# Altium schematic sheet SCH_STM32_STEPMOTOR.SchDoc
size C
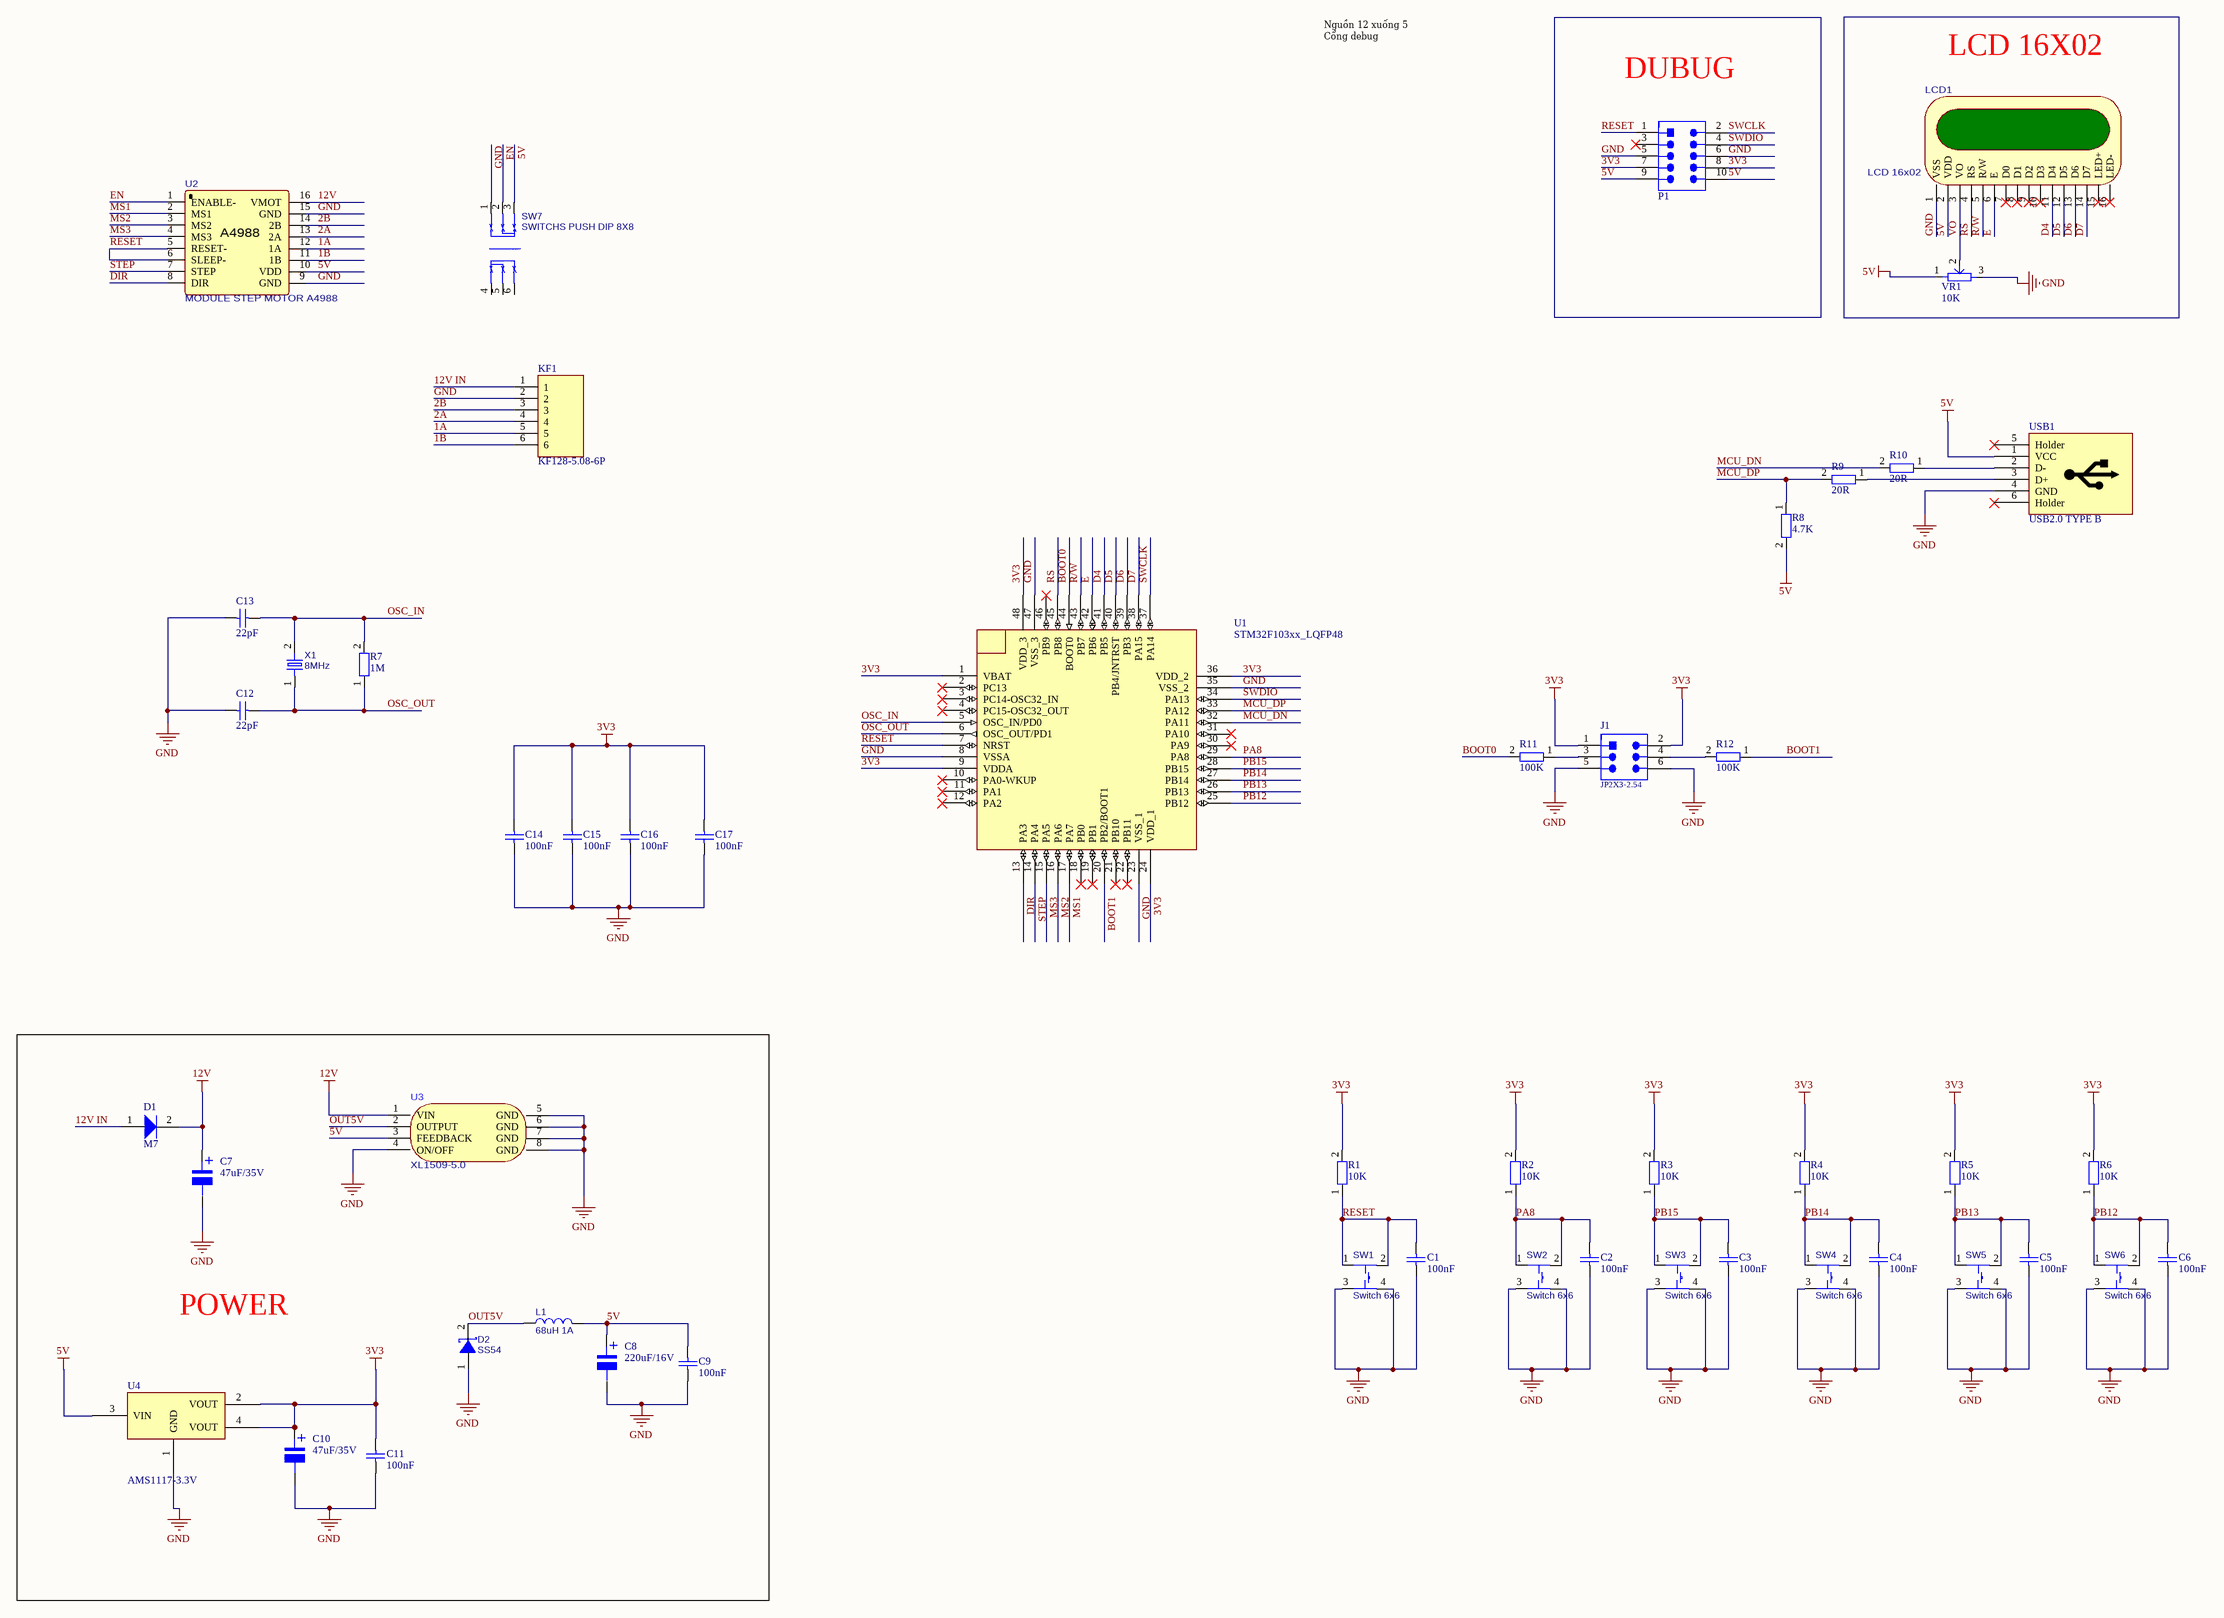
[diagram p0: SCH_STM32_STEPMOTOR.SchDoc]

## Parts
C1  100nF  [CAP CERAMIC SMD 0805 TyPE 2012]
C2  100nF  [CAP CERAMIC SMD 0805 TyPE 2012]
C3  100nF  [CAP CERAMIC SMD 0805 TyPE 2012]
C4  100nF  [CAP CERAMIC SMD 0805 TyPE 2012]
C5  100nF  [CAP CERAMIC SMD 0805 TyPE 2012]
C6  100nF  [CAP CERAMIC SMD 0805 TyPE 2012]
C7  47uF/35V  [Cap Alum SMD 6.3x5.4 TYPE D]
C8  220uF/16V  [Cap Alum SMD 6.3x7.7 TYPE D8]
C9  100nF  [CAP CERAMIC SMD 0805 TyPE 2012]
C10  47uF/35V  [Cap Alum SMD 6.3x5.4 TYPE D]
C11  100nF  [CAP CERAMIC SMD 0805 TyPE 2012]
C12  22pF  [CAP CERAMIC SMD 0805 TyPE 2012]
C13  22pF  [CAP CERAMIC SMD 0805 TyPE 2012]
C14  100nF  [CAP CERAMIC SMD 0805 TyPE 2012]
C15  100nF  [CAP CERAMIC SMD 0805 TyPE 2012]
C16  100nF  [CAP CERAMIC SMD 0805 TyPE 2012]
C17  100nF  [CAP CERAMIC SMD 0805 TyPE 2012]
D1  M7  [DIODE SMD SMA]
D2  SS54  [DO-214AC(SMA)]
J1  JP2X3-2.54  [CONNECTORS MALE HEADERS 2X3 2.54 TYPE STRAIGHT]
KF1  KF128-5.08-6P  [CONNECTORS SCREW TERMINAL KF128-5.08-6P]
L1  68uH 1A  [INDUCTOS POWER SMD CDRH]
LCD1  LCD 16x02  [LCD DISPLAYS 16X2]
P1  IDE 5X2  [CONNECTORS IDC PUSH PULL 5x2 TYPE STRAIGHT]  (value not drawn)
R1  10K  [RES CHIPS SMD 0805 TYPE 2012]
R2  10K  [RES CHIPS SMD 0805 TYPE 2012]
R3  10K  [RES CHIPS SMD 0805 TYPE 2012]
R4  10K  [RES CHIPS SMD 0805 TYPE 2012]
R5  10K  [RES CHIPS SMD 0805 TYPE 2012]
R6  10K  [RES CHIPS SMD 0805 TYPE 2012]
R7  1M  [RES CHIPS SMD 0805 TYPE 2012]
R8  4.7K  [RES CHIPS SMD 0805 TYPE 2012]
R9  20R  [RES CHIPS SMD 0805 TYPE 2012]
R10  20R  [RES CHIPS SMD 0805 TYPE 2012]
R11  100K  [RES CHIPS SMD 0805 TYPE 2012]
R12  100K  [RES CHIPS SMD 0805 TYPE 2012]
SW1  Switch 6x6  [SWITCHES TACTILE DIP 6X6x5 mm]
SW2  Switch 6x6  [SWITCHES TACTILE DIP 6X6x5 mm]
SW3  Switch 6x6  [SWITCHES TACTILE DIP 6X6x5 mm]
SW4  Switch 6x6  [SWITCHES TACTILE DIP 6X6x5 mm]
SW5  Switch 6x6  [SWITCHES TACTILE DIP 6X6x5 mm]
SW6  Switch 6x6  [SWITCHES TACTILE DIP 6X6x5 mm]
SW7  SWITCHS PUSH DIP 8X8  [SWITCHES PUSH DIP 8X8 mm]
U1  STM32F103xx_LQFP48  [LQFP-48]
U2  MODULE STEP MOTOR A4988  [MODULES STEP MOTOR A4988]
U3  XL1509-5.0  [SOP-8]
U4  AMS1117-3.3V  [SOT-223]
USB1  USB2.0 TYPE B  [CONNECTORS HOLD USB2.0 TYPE B SHRUODED]
VR1  10K  [RES VARIABLE HOLE 3362P]
X1  8MHz  [CRYSTALS HOLD HC-49S TYPE 2P]

## Nets
3V3: C10.1 C11.1 C14.1 C15.1 C16.1 C17.1 J1.1 J1.2 P1.7 P1.8 R1.2 R2.2 R3.2 R4.2 R5.2 R6.2 U1.1(VBAT) U1.9(VDDA) U1.24(VDD_1) U1.36(VDD_2) U1.48(VDD_3) U4.2(VOUT) U4.4(VOUT)
5V: C8.1 C9.1 L1.2 LCD1.2(VDD) P1.9 P1.10 R8.2 SW7.3 U2.10(VDD) U3.3(FEEDBACK) U4.3(VIN) USB1.1(VCC) VR1.1
12V: C7.1 D1.2(K) U2.16(VMOT) U3.1(VIN)
GND: C1.2 C2.2 C3.2 C4.2 C5.2 C6.2 C7.2 C8.2 C9.2 C10.2 C11.2 C12.2 C13.2 C14.2 C15.2 C16.2 C17.2 D2.1(A) J1.5 J1.6 KF1.2 LCD1.1(VSS) P1.5 P1.6 SW1.3 SW1.4 SW2.3 SW2.4 SW3.3 SW3.4 SW4.3 SW4.4 SW5.3 SW5.4 SW6.3 SW6.4 SW7.1 U1.8(VSSA) U1.23(VSS_1) U1.35(VSS_2) U1.47(VSS_3) U2.9(GND) U2.15(GND) U3.4(ON/OFF) U3.5(GND) U3.6(GND) U3.7(GND) U3.8(GND) U4.1(GND) USB1.4(GND) VR1.3
1A: KF1.5 U2.12(1A)
1B: KF1.6 U2.11(1B)
2A: KF1.4 U2.13(2A)
2B: KF1.3 U2.14(2B)
12V IN: D1.1(A) KF1.1
BOOT0: R11.2 U1.44(BOOT0)
BOOT1: R12.1 U1.20(PB2/BOOT1)
D4: LCD1.11(D4) U1.41(PB5)
D5: LCD1.12(D5) U1.40(PB4/JNTRST)
D6: LCD1.13(D6) U1.39(PB3)
D7: LCD1.14(D7) U1.38(PA15)
DIR: U1.13(PA3) U2.8(DIR)
E: LCD1.6(E) U1.42(PB6)
EN: SW7.2 U2.1(ENABLE-)
MCU_DN: R10.2 U1.32(PA11)
MCU_DP: R8.1 R9.2 U1.33(PA12)
MS1: U1.17(PA7) U2.2(MS1)
MS2: U1.16(PA6) U2.3(MS2)
MS3: U1.15(PA5) U2.4(MS3)
OSC_IN: C13.1 R7.2 U1.5(OSC_IN/PD0) X1.2
OSC_OUT: C12.1 R7.1 U1.6(OSC_OUT/PD1) X1.1
OUT5V: D2.2(K) L1.1 U3.2(OUTPUT)
PA8: C2.1 R2.1 SW2.1 SW2.2 U1.29(PA8)
PB12: C6.1 R6.1 SW6.1 SW6.2 U1.25(PB12)
PB13: C5.1 R5.1 SW5.1 SW5.2 U1.26(PB13)
PB14: C4.1 R4.1 SW4.1 SW4.2 U1.27(PB14)
PB15: C3.1 R3.1 SW3.1 SW3.2 U1.28(PB15)
R/W: LCD1.5(R/W) U1.43(PB7)
RESET: C1.1 P1.1 R1.1 SW1.1 SW1.2 U1.7(NRST) U2.5(RESET-) U2.6(SLEEP-)
RS: LCD1.4(RS) U1.45(PB8)
STEP: U1.14(PA4) U2.7(STEP)
SWCLK: P1.2 U1.37(PA14)
SWDIO: P1.4 U1.34(PA13)
VO: LCD1.3(VO) VR1.2
NetJ1_3: J1.3 R11.1
NetJ1_4: J1.4 R12.2
NetR9_1: R9.1 USB1.3(D+)
NetR10_1: R10.1 USB1.2(D-)

Not connected (* = marked no-connect by the designer): LCD1 7(D0)* 8(D1)* 9(D2)* 10(D3)* 15(LED+)* 16(LED-)*; P1 3*; SW7 4 5 6; U1 2(PC13)* 3(PC14-OSC32_IN)* 4(PC15-OSC32_OUT)* 10(PA0-WKUP)* 11(PA1)* 12(PA2)* 18(PB0)* 19(PB1)* 21(PB10)* 22(PB11)* 30(PA9)* 31(PA10)* 46(PB9)*; USB1 5(Holder)* 6(Holder)*

## Notes on the sheet
- DUBUG
- LCD 16X02
- Nguồn 12 xuống 5
  Cổng debug
- POWER
- (in symbol CAP ALUMINUM SMD) +
- (in symbol LCD DISPLAYS 16x02) 16x2
- (in symbol MODULE STEPMOTOR A4988) A4988

## Library data of the parts
C1-C6 C9 C11-C17 = CAP 0805 50V 10%: 0805 Multilayer Ceramic Capacitors MLCC - SMD/SMT ROHS
C7 C8 C10 = CAP ALUMINUM SMD: Aluminum Electrolytic Capacitors - SMD ROHS; Chung_Loai: Dán; Don_Vi: Con; So_Chan: 2; Ma_Hang: MH004419; Kieu_Chan: *
D1 = DIODE SMD 1N4007: 1A 1kV Diodes - General Purpose ROHS; Chung_Loai: Dán; Don_Vi: Con; Ten_Linh_Kien: Diode M7 1N4007 SMD 1A 1000V; Ma_Hang: MH000944; Ghi_Chu: *; Supplier 1: RSComponents
D2 = DIODE SMD SS54: 500uA@40V 40V 550mV@5A 5A SMA(DO-214AC) Schottky Barrier Diodes (SBD) ROHS; BOM_Manufacturer: JH; BOM_Manufacturer Part: SS34; Contributor: LCSC; BOM_Supplier: LCSC; BOM_Supplier Part: C478723; BOM_JLCPCB Part Class: Extended Part; spicePre: D; spiceSymbolName: SS34_C478723; Supplier 1: Farnell
J1 = CONNECTORS MALE HEADERS 2X3 2.54: WR-PHD Pin Header, THT, pitch 2.54mm, Dual Row, Angled, 6p; Manufacturer Part Number: 61300621021; Manufacturer: Wurth Elektronik; Pin Number: 6; Rated Current: 3A; Working Voltage: 250VAC; Withstanding Voltage: 500VAC; Contact Resistance: 20mOhm; ComponentLink1Description: Manufacturer; ComponentLink1URL: http://www.we-online.de; ComponentLink2Description: Datasheet; ComponentLink2URL: https://www.we-online.com/catalog/datasheet/61300621021.pdf; Pitch: 2.54mm; Operating Temperature: -40 to +105degC; Mounting Technology: THT; Packaging: Bag; Gender: Pin Header; Row Number: Dual; Orientation: Angled
KF1 = CONNECTORS SCREW TERMINAL KF128-5.08-6P: 2~24 Poles, Screw Type, Horizontal, 5.08 Pitch, 24~12 _AWG_, Terminal Block Connector; MP: TB004-508-06GR; Price: None; Package: None; Availability: Unavailable; Value: *
L1 = INDUCTORS SMD: BOM_Manufacturer: Yanchuang(研创); BOM_Manufacturer Part: SCHF160808H47NJT; nameAlias: Inductance; Contributor: LCSC; BOM_Supplier: LCSC; BOM_Supplier Part: C578001; BOM_JLCPCB Part Class: Extended Part; spicePre: L; spiceSymbolName: SCHF160808H47NJT
LCD1 = LCD DISPLAYS 16x02: LCD Displays Modules 16x02 5V ROHS
P1 = CONNECTORS IDC 5X2: WR-BHD Box Header, Male, pitch 2.54mm, SMT, Straight, 10p; Manufacturer: Wurth Elektronik; Manufacturer Part Number: 61201020621; Contact Resistance: 20mOhm; Insulation Resistance: 1000MOhm; Number of Positions: 10; Rated Current: 3A; Withstanding Voltage: 500V; Working Voltage: 250V; ComponentLink1Description: Manufacturer Link; ComponentLink1URL: http://www.we-online.de; ComponentLink2Description: Datasheet; ComponentLink2URL: https://www.we-online.com/catalog/datasheet/61201020621.pdf; Gender: Male; Height: 9.1mm; Length: 20.2mm; Mounting Technology: SMT; Number of Rows: 2; Operating Temperature max.: 125C; Operating Temperature min.: -40C; Orientation: Straight; Packaging: Tube; Pitch: 2.54mm; Width: 8.8mm
R1-R12 = RES 0805 1%: ±1% - Chip Resistor - Surface Mount ROHS; Chung_Loai: Dán; Don_Vi: Con; So_Chan: 2; Ma_Hang: MH005880; Kieu_Chan: *
SW1-SW6 = Switches Tactile 6x6mm: BOM_Manufacturer: OMRON(欧姆龙); BOM_Manufacturer Part: B3F-1000; Contributor: LCSC; BOM_Supplier: LCSC; BOM_Supplier Part: C93157; BOM_JLCPCB Part Class: Extended Part; spicePre: S; spiceSymbolName: B3F-1000
SW7 = SWITCHS PUSH DIP 8X8: Rectangle button No lock Straight 160gf@±80gf 250V 30V 100MΩ 100000 PCPin No -15℃~+55℃ Blue 100mA Plugin Push Switches ROHS; BOM_Manufacturer: XKB Enterprise; BOM_Manufacturer Part: XKB8080-W; Contributor: LCSC; BOM_Supplier: LCSC; BOM_Supplier Part: C318861; BOM_JLCPCB Part Class: Extended Part; spicePre: S; spiceSymbolName: XKB8080-W
U1 = MCU_STM32F103xx: 64KB -40℃~+85℃ ARM Cortex-M3 20KB 72MHz FLASH 12bit 37 LQFP-48(7x7) Microcontroller Units (MCUs/MPUs/SOCs) ROHS; Published: 30-May-2008; DatasheetVersion: rev6, Mar-2008; PackageVersion: Mar-2008; PackageReference: LQFP48; Publisher: Altium Limited; PackageDescription: 48-Pin Low-Profile Quad Flat Pack, 7 x 7 mm Body, 0.5 mm Pitch (LQFP48); ComponentLink1Description: Manufacturer Link; ComponentLink1URL: www.st.com/stm32; ComponentLink2Description: Datasheet; ComponentLink2URL: http://www.st.com/stonline/products/literature/ds/13587.pdf
U2 = MODULE STEPMOTOR A4988: MODULES STEP MOTOR A4988
U3 = POWER CONVERTER XL1509-5.0: SOP-8 DC-DC Converters ROHS
U4 = POWER CONVERTERS AMS117-3V3: 800mA 1.4V@(1A) Fixed 3.3V~3.3V Positive 1 18V SOT-223 Linear Voltage Regulators (LDO) ROHS; Value: AMS1117-3.3V SOT223; Don_Vi: Con; Ma_Hang: MH000596; Chung_Loai: Dán; Ghi_Chu: *; Kieu_Chan: *
USB1 = CONNECTORS USB 2.0 DIP TYPE B: Value: USB type B
VR1 = RES VARIABLE DIP: Plugin Variable Resistors/Potentiometers ROHS; Ma_Hang: MH000919; Don_Vi: Con; Ten_Linh_Kien: Biến Trở Tam Giác 103-10K RM065 (Chân Đứng); Chung_Loai: Cắm; Kieu_Chan: *
X1 = CRYSTALS 2P: Crystals ROHS; BOM_Manufacturer: TAITIEN(泰艺电子); BOM_Manufacturer Part: XIHCELNANF-12MHZ; nameAlias: Frequency; Contributor: LCSC; BOM_Supplier: LCSC; BOM_Supplier Part: C295072; BOM_JLCPCB Part Class: Extended Part; spicePre: X; spiceSymbolName: XIHCELNANF-12MHZ